# Altium schematic sheet TOC_and_Revision.SchDoc: TOC_and_Revision
size B; Organization: Myomo; Address1: 137 PORTLAND STREET, 4TH FLOOR; Address2: BOSTON, MA 02114; Address3: USA; SheetNumber: 1
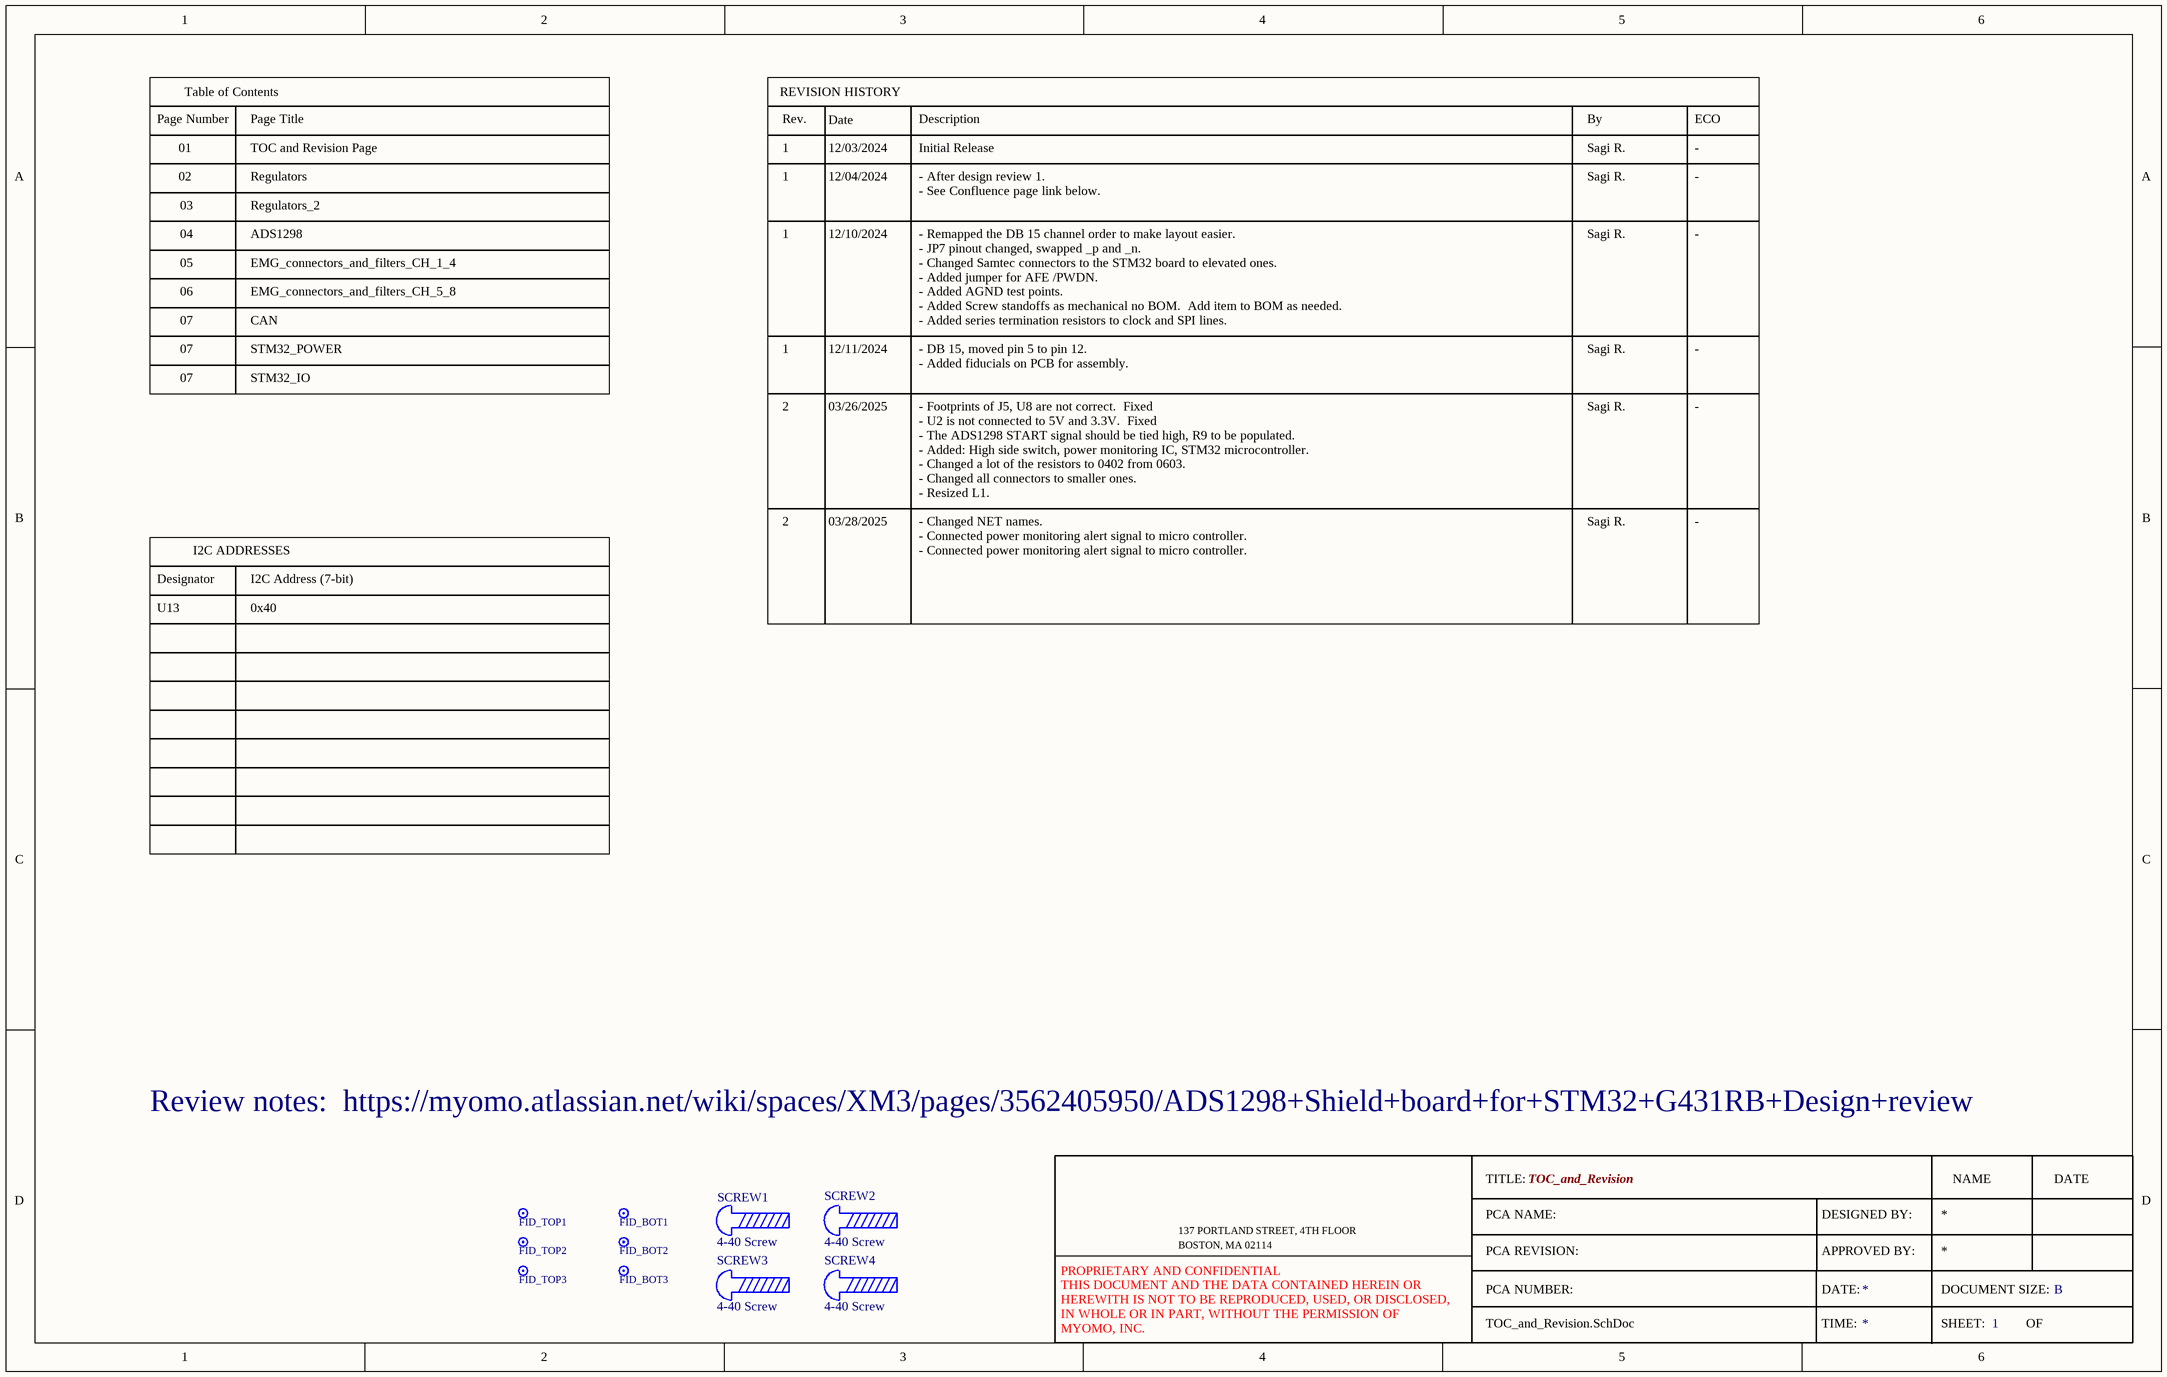
[diagram p0: TOC_and_Revision.SchDoc]

## Parts
FID_BOT1  FID_BOT  [Fiducial_Bot]  (value not drawn)  (no BOM)
FID_BOT2  FID_BOT  [Fiducial_Bot]  (value not drawn)  (no BOM)
FID_BOT3  FID_BOT  [Fiducial_Bot]  (value not drawn)  (no BOM)
FID_TOP1  FID_TOP  [Fiducial_Top]  (value not drawn)  (no BOM)
FID_TOP2  FID_TOP  [Fiducial_Top]  (value not drawn)  (no BOM)
FID_TOP3  FID_TOP  [Fiducial_Top]  (value not drawn)  (no BOM)
SCREW1  4-40 Screw  [SCREW_4-40_STANDOFF]  (no BOM)
SCREW2  4-40 Screw  [SCREW_4-40_STANDOFF]  (no BOM)
SCREW3  4-40 Screw  [SCREW_4-40_STANDOFF]  (no BOM)
SCREW4  4-40 Screw  [SCREW_4-40_STANDOFF]  (no BOM)

## Notes on the sheet
- Table of Contents
- REVISION HISTORY
- Page Number
- 01
- Page Title
- TOC and Revision Page
- Rev.
- 1
- Date
- 12/03/2024
- Description
- Initial Release
- By
- Sagi R.
- ECO
- -
- 02
- 03
- 04
- Regulators
- ADS1298
- Regulators_2
- 12/04/2024
- 12/10/2024
- - After design review 1.
- - See Confluence page link below.
- - Remapped the DB 15 channel order to make layout easier.
- - JP7 pinout changed, swapped _p and _n.
- 05
- 06
- EMG_connectors_and_filters_CH_1_4
- EMG_connectors_and_filters_CH_5_8
- - Changed Samtec connectors to the STM32 board to elevated ones.
- - Added jumper for AFE /PWDN.
- - Added AGND test points.
- - Added Screw standoffs as mechanical no BOM.  Add item to BOM as needed.
- 07
- CAN
- STM32_IO
- STM32_POWER
- 12/11/2024
- - Added series termination resistors to clock and SPI lines.
- - DB 15, moved pin 5 to pin 12.
- - Added fiducials on PCB for assembly.
- 2
- 03/26/2025
- - Footprints of J5, U8 are not correct.  Fixed
- - U2 is not connected to 5V and 3.3V.  Fixed
- - The ADS1298 START signal should be tied high, R9 to be populated.
- - Added: High side switch, power monitoring IC, STM32 microcontroller.
- 03/28/2025
- - Changed a lot of the resistors to 0402 from 0603.
- - Changed all connectors to smaller ones.
- - Resized L1.
- - Changed NET names.
- - Connected power monitoring alert signal to micro controller.
- Designator
- I2C ADDRESSES
- I2C Address (7-bit)
- U13
- 0x40
- Review notes:  https://myomo.atlassian.net/wiki/spaces/XM3/pages/3562405950/ADS1298+Shield+board+for+STM32+G431RB+Design+review
- TITLE:
- NAME
- DATE
- PCA REVISION:
- PCA NAME:
- APPROVED BY:
- DESIGNED BY:
- PCA NUMBER:
- DATE:
- TIME:
- DOCUMENT SIZE:
- SHEET:
- OF
- B
- PROPRIETARY AND CONFIDENTIAL
  THIS DOCUMENT AND THE DATA CONTAINED HEREIN OR HEREWITH IS NOT TO BE REPRODUCED, USED, OR DISCLOSED, IN WHOLE OR IN PART, WITHOUT THE PERMISSION OF
  MYOMO, INC.

## Library data of the parts
FID_BOT1-FID_BOT3 = FID_BOT: Fiducial
FID_TOP1-FID_TOP3 = FID_TOP: Fiducial
SCREW1-SCREW4 = SCREW_4-40_STANDOFF: 4-40 standoff; MFG: none; MFGPN: 4-40 Screw